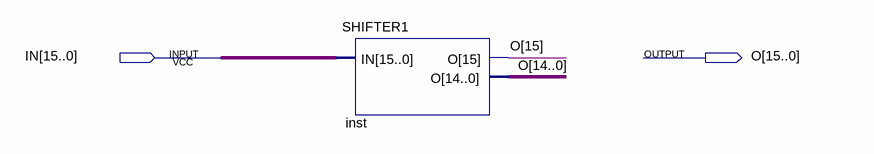
[diagram p0: schematic sheet]
// Quartus schematic SHIFTER1V1.bdf as structural Verilog: 1 symbols, 2 pins
module SHIFTER1V1 (
  input  [15:0] IN,
  output [15:0] O
);

  SHIFTER1 inst (.IN(IN), .O(O));
endmodule
